# EAGLE design makey_makey (EAGLE 7.2.0)

## Sheet 1 of 2
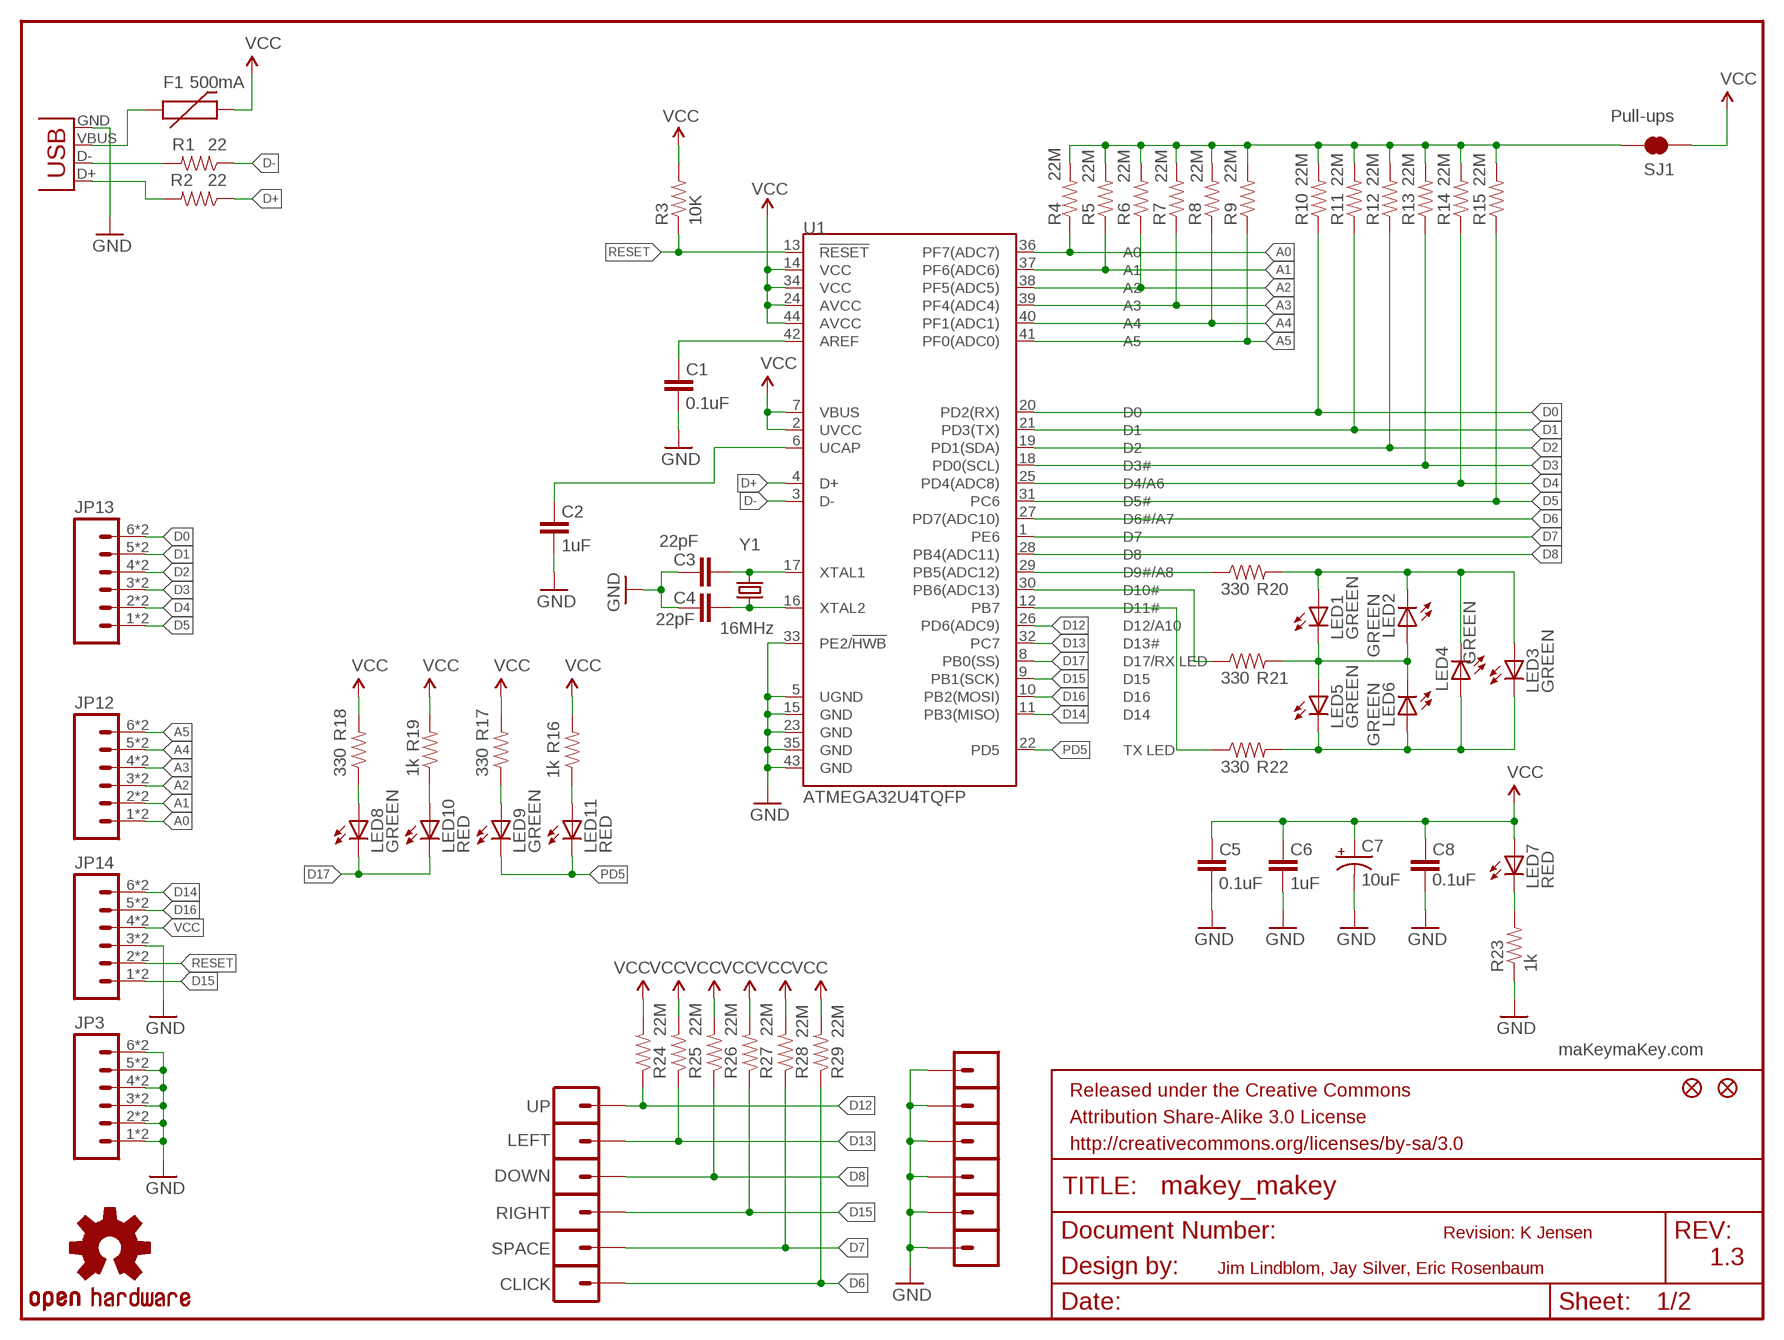
[diagram p0: schematic, sheet 1]

### Parts
C1  0.1uF  CAP0603-CAP  [0603-CAP]
C2  1uF  CAP0603-CAP  [0603-CAP]
C3  22pF  CAP0603-CAP  [0603-CAP]
C4  22pF  CAP0603-CAP  [0603-CAP]
C5  0.1uF  CAP0603-CAP  [0603-CAP]
C6  1uF  CAP0603-CAP  [0603-CAP]
C7  10uF  CAP_POL1206  [EIA3216]
C8  0.1uF  CAP0603-CAP  [0603-CAP]
CLICK  M01ALLIGATOR-3MM  [1X01_ALLIGATOR_3MM]
DOWN  M01ALLIGATOR-3MM  [1X01_ALLIGATOR_3MM]
F1  500mA  PTCSMD-W  [PTC-1206-WIDE]
JP1  FIDUCIALUFIDUCIAL  [MICRO-FIDUCIAL]
JP2  FIDUCIALUFIDUCIAL  [MICRO-FIDUCIAL]
JP3  M06SMD-STRAIGHT-COMBO  [1X06_SMD_STRAIGHT_COMBO]
JP5  M01ALLIGATOR-3MM  [1X01_ALLIGATOR_3MM]
JP6  M01ALLIGATOR-3MM  [1X01_ALLIGATOR_3MM]
JP7  M01ALLIGATOR-3MM  [1X01_ALLIGATOR_3MM]
JP8  M01ALLIGATOR-3MM  [1X01_ALLIGATOR_3MM]
JP10  M01ALLIGATOR-3MM  [1X01_ALLIGATOR_3MM]
JP11  M01ALLIGATOR-3MM  [1X01_ALLIGATOR_3MM]
JP12  M06SMD-STRAIGHT-COMBO  [1X06_SMD_STRAIGHT_COMBO]
JP13  M06SMD-STRAIGHT-COMBO  [1X06_SMD_STRAIGHT_COMBO]
JP14  M06SMD-STRAIGHT-COMBO  [1X06_SMD_STRAIGHT_COMBO]
LED1  GREEN  LED1206-BOTTOM  [LED-1206-BOTTOM]
LED2  GREEN  LED1206-BOTTOM  [LED-1206-BOTTOM]
LED3  GREEN  LED1206-BOTTOM  [LED-1206-BOTTOM]
LED4  GREEN  LED1206-BOTTOM  [LED-1206-BOTTOM]
LED5  GREEN  LED1206-BOTTOM  [LED-1206-BOTTOM]
LED6  GREEN  LED1206-BOTTOM  [LED-1206-BOTTOM]
LED7  RED  LED0603  [LED-0603]
LED8  GREEN  LED0603  [LED-0603]
LED9  GREEN  LED0603  [LED-0603]
LED10  RED  LED0603  [LED-0603]
LED11  RED  LED0603  [LED-0603]
LEFT  M01ALLIGATOR-3MM  [1X01_ALLIGATOR_3MM]
R1  22  RESISTOR0603-RES  [0603-RES]
R2  22  RESISTOR0603-RES  [0603-RES]
R3  10K  RESISTOR0603-RES  [0603-RES]
R4  22M  RESISTOR0603-RES  [0603-RES]
R5  22M  RESISTOR0603-RES  [0603-RES]
R6  22M  RESISTOR0603-RES  [0603-RES]
R7  22M  RESISTOR0603-RES  [0603-RES]
R8  22M  RESISTOR0603-RES  [0603-RES]
R9  22M  RESISTOR0603-RES  [0603-RES]
R10  22M  RESISTOR0603-RES  [0603-RES]
R11  22M  RESISTOR0603-RES  [0603-RES]
R12  22M  RESISTOR0603-RES  [0603-RES]
R13  22M  RESISTOR0603-RES  [0603-RES]
R14  22M  RESISTOR0603-RES  [0603-RES]
R15  22M  RESISTOR0603-RES  [0603-RES]
R16  1k  RESISTOR0603-RES  [0603-RES]
R17  330  RESISTOR0603-RES  [0603-RES]
R18  330  RESISTOR0603-RES  [0603-RES]
R19  1k  RESISTOR0603-RES  [0603-RES]
R20  330  RESISTOR0603-RES  [0603-RES]
R21  330  RESISTOR0603-RES  [0603-RES]
R22  330  RESISTOR0603-RES  [0603-RES]
R23  1k  RESISTOR0603-RES  [0603-RES]
R24  22M  RESISTOR0603-RES  [0603-RES]
R25  22M  RESISTOR0603-RES  [0603-RES]
R26  22M  RESISTOR0603-RES  [0603-RES]
R27  22M  RESISTOR0603-RES  [0603-RES]
R28  22M  RESISTOR0603-RES  [0603-RES]
R29  22M  RESISTOR0603-RES  [0603-RES]
RIGHT  M01ALLIGATOR-3MM  [1X01_ALLIGATOR_3MM]
SJ1  Pull-ups  SOLDERJUMPER-OLDTRACE  [SJ_2S-TRACE]
SPACE  M01ALLIGATOR-3MM  [1X01_ALLIGATOR_3MM]
U1  ATMEGA32U4TQFP  [TQFP44]
U$1  OSHW-LOGOM  [OSHW-LOGO-M]
UP  M01ALLIGATOR-3MM  [1X01_ALLIGATOR_3MM]
X1  USBSMD  [USB-MINIB]
Y1  16MHz  CRYSTAL5X3  [CRYSTAL-SMD-5X3]

### Nets
A0: JP12.1 JP12.1-2 R4.1 U1.36(PF7(ADC7))
A1: JP12.2 JP12.2-2 R5.1 U1.37(PF6(ADC6))
A2: JP12.3 JP12.3-2 R6.1 U1.38(PF5(ADC5))
A3: JP12.4 JP12.4-2 R7.1 U1.39(PF4(ADC4))
A4: JP12.5 JP12.5-2 R8.1 U1.40(PF1(ADC1))
A5: JP12.6 JP12.6-2 R9.1 U1.41(PF0(ADC0))
AREF: C1.2 U1.42(AREF)
D0: JP13.6 JP13.6-2 R10.1 U1.20(PD2(RX))
D1: JP13.5 JP13.5-2 R11.1 U1.21(PD3(TX))
D2: JP13.4 JP13.4-2 R12.1 U1.19(PD1(SDA))
D3: JP13.3 JP13.3-2 R13.1 U1.18(PD0(SCL))
D4: JP13.2 JP13.2-2 R14.1 U1.25(PD4(ADC8))
D5: JP13.1 JP13.1-2 R15.1 U1.31(PC6)
D6: CLICK.1@0 CLICK.1@2 R29.1 U1.27(PD7(ADC10))
D7: R28.1 SPACE.1@0 SPACE.1@2 U1.1(PE6)
D8: DOWN.1@0 DOWN.1@2 R26.1 U1.28(PB4(ADC11))
D9: R20.1 U1.29(PB5(ADC12))
D10: R21.1 U1.30(PB6(ADC13))
D11: R22.1 U1.12(PB7)
D12: R24.1 U1.26(PD6(ADC9)) UP.1@0 UP.1@2
D13: LEFT.1@0 LEFT.1@2 R25.1 U1.32(PC7)
D14: JP14.6 JP14.6-2 U1.11(PB3(MISO))
D15: JP14.1 JP14.1-2 R27.1 RIGHT.1@0 RIGHT.1@2 U1.9(PB1(SCK))
D16: JP14.5 JP14.5-2 U1.10(PB2(MOSI))
D17: LED8.C LED10.C U1.8(PB0(SS))
D+: R2.1 U1.4(D+)
D-: R1.1 U1.3(D-)
GND [vcc]: C1.1 C2.1 C3.2 C4.2 C5.1 C6.1 C7.C(-) C8.1 JP3.1 JP3.1-2 JP3.2 JP3.2-2 JP3.3 JP3.3-2 JP3.4 JP3.4-2 JP3.5 JP3.5-2 JP3.6 JP3.6-2 JP5.1@0 JP5.1@2 JP6.1@0 JP6.1@2 JP7.1@0 JP7.1@2 JP8.1@0 JP8.1@2 JP10.1@0 JP10.1@2 JP11.1@0 JP11.1@2 JP14.3 JP14.3-2 R23.1 U1.5(UGND) U1.15(GND) U1.23(GND) U1.33(PE2/!HWB) U1.35(GND) U1.43(GND) X1.GND
N$1: C4.1 U1.16(XTAL2) Y1.1
N$2: C3.1 U1.17(XTAL1) Y1.3
N$3: LED8.A R18.1
N$4: C2.2 U1.6(UCAP)
N$5: F1.1 X1.VBUS
N$6: R1.2 X1.D-
N$7: LED7.C R23.2
N$8: R2.2 X1.D+
N$9: LED11.A R16.1
N$10: LED10.A R19.1
N$11: LED9.A R17.1
N$24: LED1.C LED2.A LED5.A LED6.C R21.2
N$25: LED1.A LED2.C LED3.A LED4.C R20.2
N$26: LED3.C LED4.A LED5.C LED6.A R22.2
PD5: LED9.C LED11.C U1.22(PD5)
PULL-UP: R4.2 R5.2 R6.2 R7.2 R8.2 R9.2 R10.2 R11.2 R12.2 R13.2 R14.2 R15.2 SJ1.2
RESET: JP14.2 JP14.2-2 R3.1 U1.13(!RESET)
VCC: C5.2 C6.2 C7.A(+) C8.2 F1.2 JP14.4 JP14.4-2 LED7.A R3.2 R16.2 R17.2 R18.2 R19.2 R24.2 R25.2 R26.2 R27.2 R28.2 R29.2 SJ1.1 U1.2(UVCC) U1.7(VBUS) U1.14(VCC) U1.24(AVCC) U1.34(VCC) U1.44(AVCC)

### Notes on the sheet
- maKeymaKey.com
- Revision: K Jensen
- 1.3
- Jim Lindblom, Jay Silver, Eric Rosenbaum

## Sheet 2 of 2
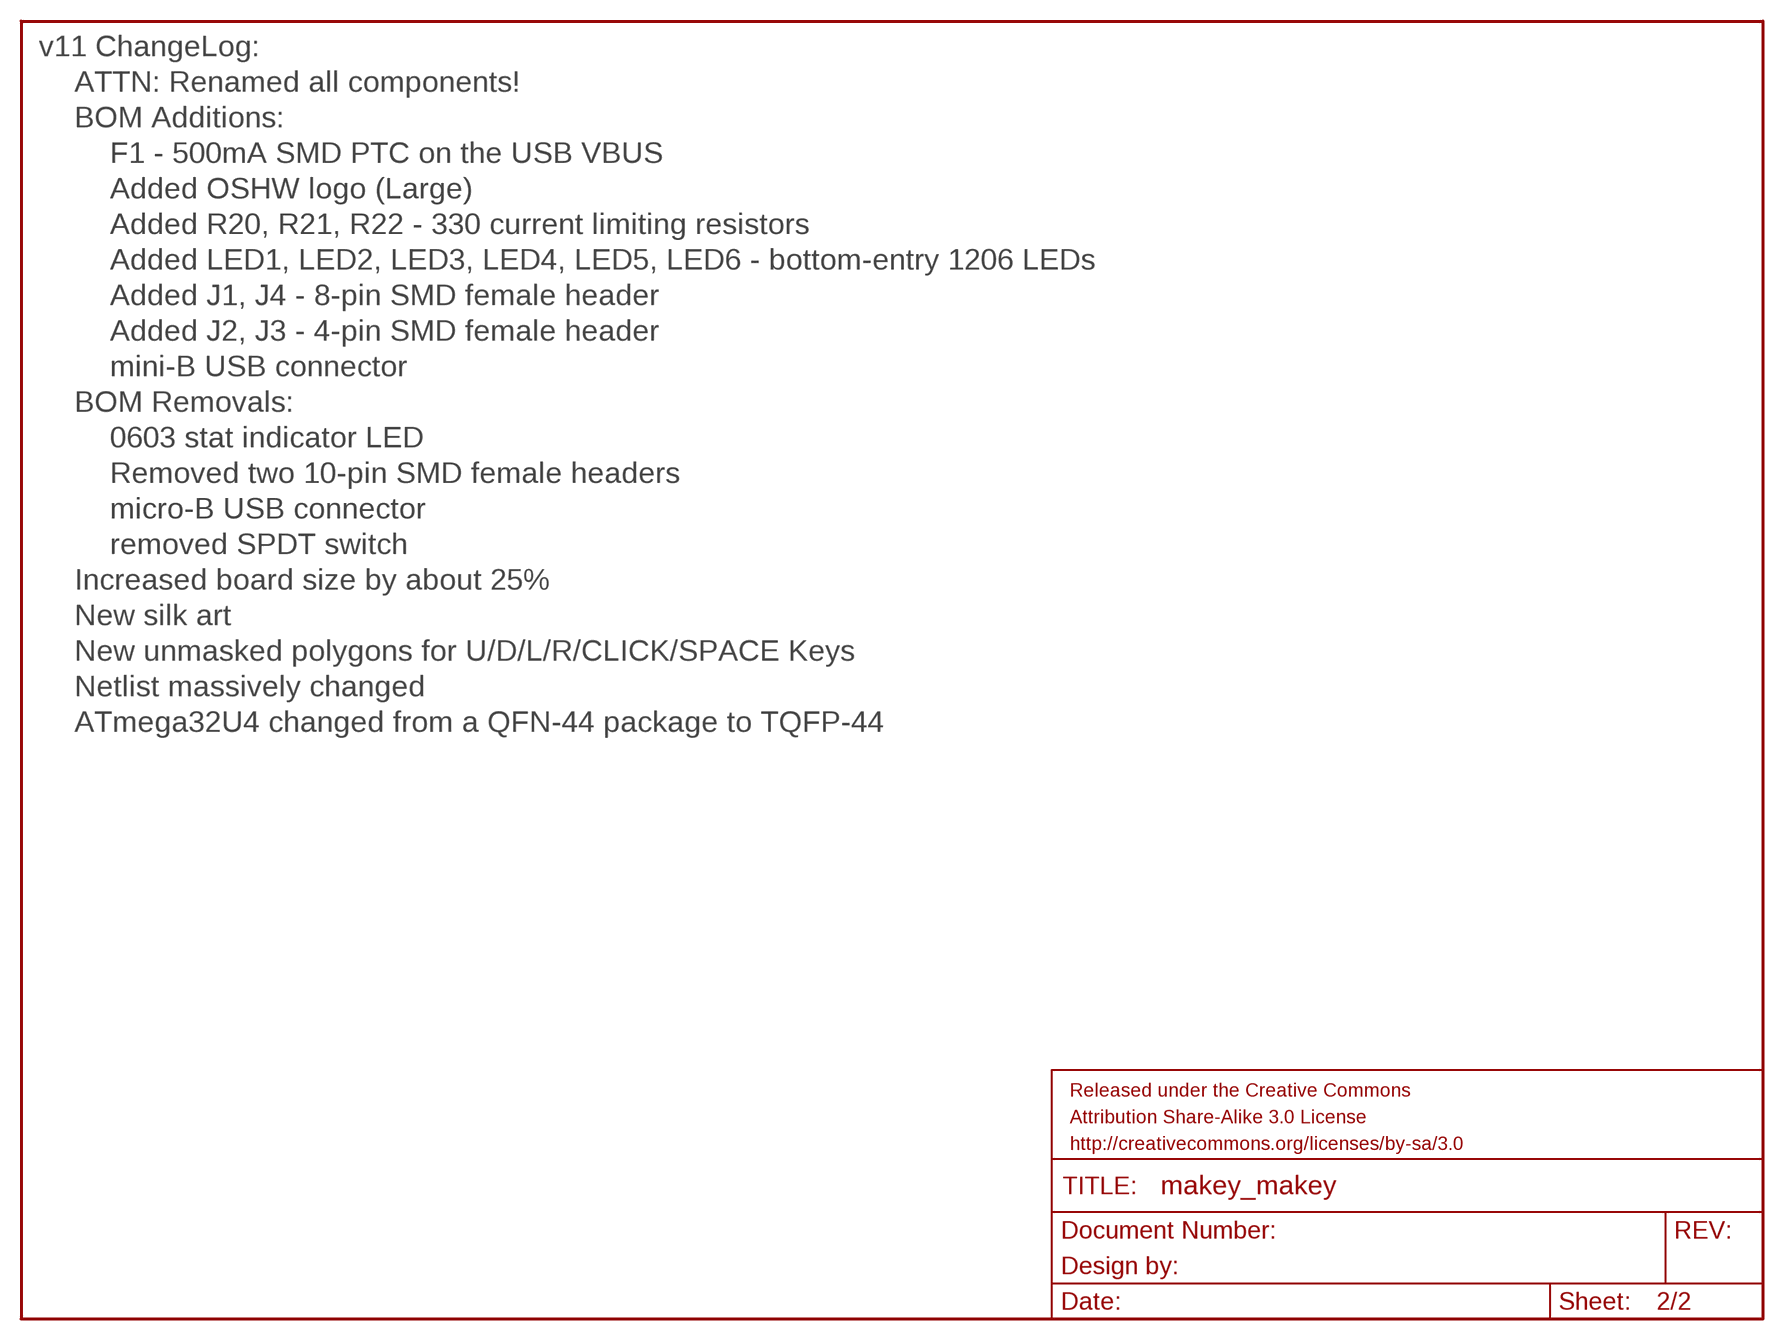
[diagram p1: schematic, sheet 2]

### Notes on the sheet
- v11 ChangeLog:
- ATTN: Renamed all components!
- BOM Additions:
- F1 - 500mA SMD PTC on the USB VBUS
- Added OSHW logo (Large)
- Added R20, R21, R22 - 330 current limiting resistors
- Added LED1, LED2, LED3, LED4, LED5, LED6 - bottom-entry 1206 LEDs
- Added J1, J4 - 8-pin SMD female header
- Added J2, J3 - 4-pin SMD female header
- mini-B USB connector
- BOM Removals:
- 0603 stat indicator LED
- Removed two 10-pin SMD female headers
- micro-B USB connector
- removed SPDT switch
- Increased board size by about 25%
- New silk art
- New unmasked polygons for U/D/L/R/CLICK/SPACE Keys
- Netlist massively changed
- ATmega32U4 changed from a QFN-44 package to TQFP-44

## Library data of the parts
C1-C6 C8 = SparkFun:CAP: Capacitor Standard 0603 ceramic capacitor, and 0.1" leaded capacitor.
C7 = SparkFun:CAP_POL: Capacitor Polarized These are standard SMD and PTH capacitors. Normally 10uF, 47uF, and 100uF in electrolytic and tantalum varieties. Always verify the external diameter of the through hole cap, it varies with capacity, voltage, and manufacturer. The EIA devices should be standard.
CLICK DOWN JP5-JP8 JP10 JP11 LEFT RIGHT SPACE UP = SparkFun-Connectors:M01: Header 1 Standard 1-pin 0.1" header. Use with straight break away headers (SKU : PRT-00116), right angle break away headers (PRT-00553), swiss pins (PRT-00743), machine pins (PRT-00117), and female headers (PRT-00115).
F1 = SparkFun-PowerIC:PTC: Resettable Fuse PTC Resettable Fuse. Spark Fun Electronics SKU : COM-08357
JP1 JP2 = SparkFun:FIDUCIAL: Fiducial Alignment Points Various fiducial points for machine vision alignment.
JP3 JP12-JP14 = SparkFun-Connectors:M06: Header 6 Standard 6-pin 0.1" header. Use with straight break away headers (SKU : PRT-00116), right angle break away headers (PRT-00553), swiss pins (PRT-00743), machine pins (PRT-00117), and female headers (PRT-00115). Molex polarized connector foot print use with SKU : PRT-08094 with associated crimp pins and housings. NOTES ON THE VARIANTS LOCK and LOCK_LONGPADS... This footprint was designed to help hold the alignment of a through-hole component (i.e. 6-pin header) while soldering it into place. You may notice that each hole has been shifted either up or down by 0.005 of an inch from it's more standard position (which is a perfectly straight line). This slight alteration caused the pins (the squares in the middle) to touch the edges of the holes. Because they are alternating, it causes a "brace" to hold the component in place. 0.005 has proven to be the perfect amount of "off-center" position when using our standard breakaway headers. Although looks a little odd when you look at the bare footprint, once you have a header in there, the alteration is very hard to notice. Also, if you push a header all the way into place, it is covered up entirely on the bottom side. This idea of altering the position of holes to aid alignment will be further integrated into the Sparkfun Library for other footprints. It can help hold any component with 3 or more connection pins.
LED1-LED6 LED8-LED11 = SparkFun-LED:LED: LEDs Standard schematic elements and footprints for 5mm, 3mm, 1206, and 0603 sized LEDs. 5mm - Spark Fun Electronics SKU : COM-00529 (and others)
LED7 = SparkFun:LED: LEDs Standard schematic elements and footprints for 5mm, 3mm, 1206, and 0603 sized LEDs. 5mm - Spark Fun Electronics SKU : COM-00529 (and others)
R1-R15 R23-R29 = SparkFun:RESISTOR: Resistor Basic schematic elements and footprints for 0603, 1206, and PTH resistors.
R16-R22 = SparkFun-Passives:RESISTOR: Resistor Basic schematic elements and footprints for 0603, 1206, and PTH resistors.
SJ1 = SparkFun:SOLDERJUMPER-OLD: Solder Jumper Standard SMD solder jumper. Used to automate production. Two varients : Normally Open and Normally Closed are the same, but have different paste layers. NC will have a large amount of paste and should jumper during reflow.
U1 = SparkFun-DigitalIC:ATMEGA32U4: Atmel 44-pin 8-bit Microcontroller with 32KBytes of ISP Flash and USB Controller
U$1 = SparkFun-Aesthetics:OSHW-LOGO: Open Source Hardware Logo This logo indicates the piece of hardware it is found on incorporates a OSHW license and/or adheres to the definition of open source hardware found here: http://freedomdefined.org/OSHW
X1 = SparkFun:USB: USB Connectors USB-B-PTH is fully proven SKU : PRT-00139 USB-miniB is fully proven SKU : PRT-00587 USB-A-PCB is untested. USB-A-H is throughly reviewed, but untested. Spark Fun Electronics SKU : PRT-00437 USB-B-SMT is throughly reviewed, but untested. Needs silkscreen touching up. USB-A-S has not been used/tested USB-MB-H has not been used/tested
Y1 = SparkFun:CRYSTAL: Crystals Various standard crystals. Proven footprints. Spark Fun Electronics SKU : COM-00534

## Net classes
0 default: width 0.203 mm

## Board
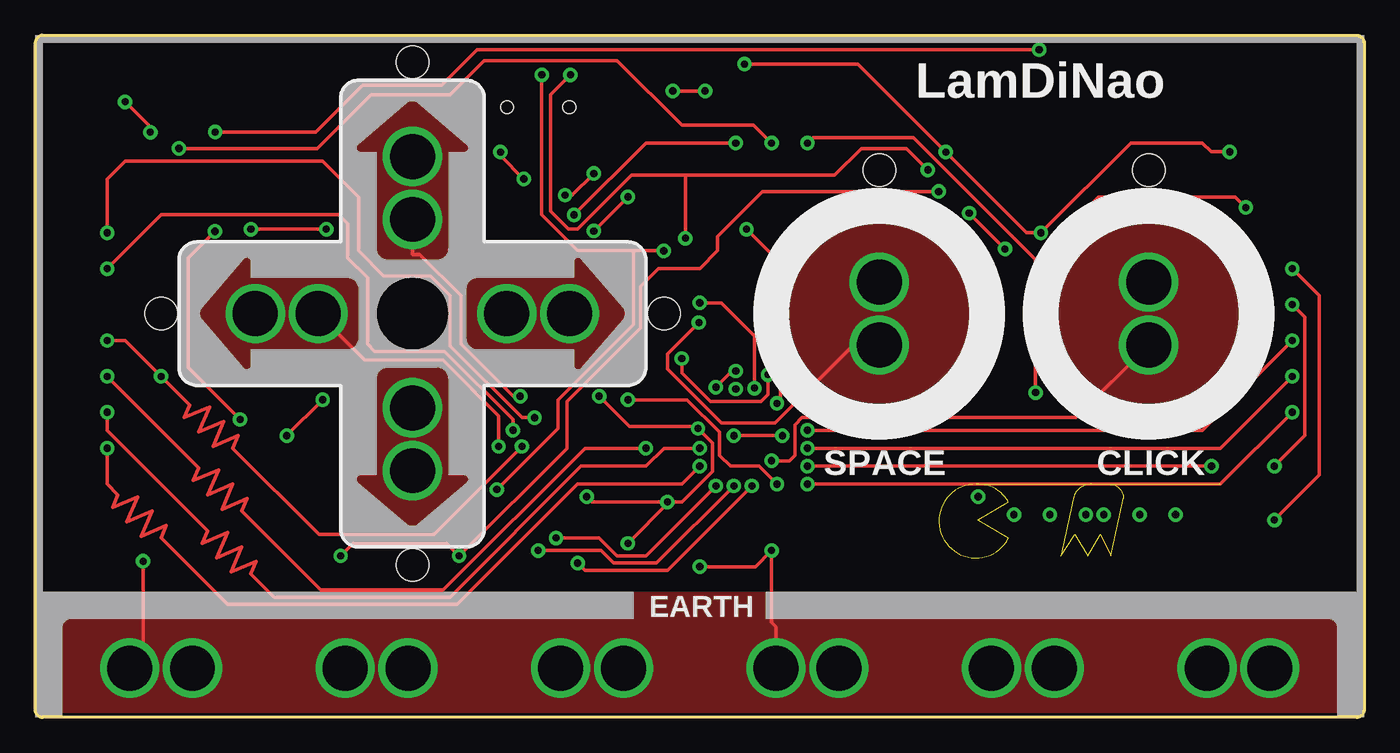
[diagram p2: board, top side]
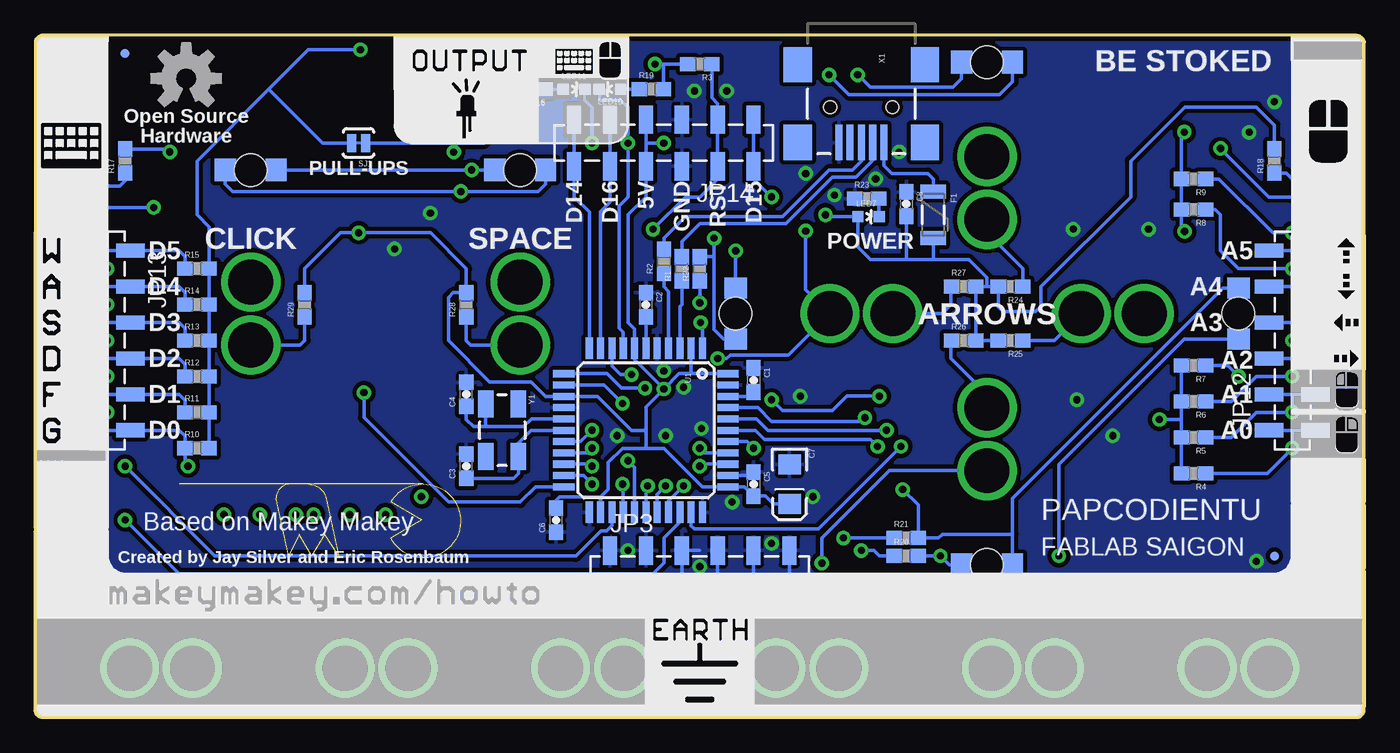
[diagram p3: board, bottom side, seen from below]

Size 93.98 x 48.26 mm. Coordinates in mm from the lower left corner, seen from the top.
Outline: 0,0.54 0,47.72 arc-90 0.54,48.26 93.44,48.26 arc-90 93.98,47.72 93.98,0.54 arc-90 93.44,0 0.54,0 arc-90 0,0.54
Copper layers (1*16): Top 0.035mm / dielectric 1.5mm / Bottom 0.035mm
Design rules "default": minimum track width 8mil, minimum drill 20mil, track to track 8mil, track to pad 8mil, pad to pad 8mil, via to via 8mil, smd to smd 8mil, copper to edge 8mil, drill to drill 8mil, minimum pad ring 12mil, minimum via ring 10mil, stop-mask expansion 4mil, vias tented up to drill 20mil, thermal gap 10mil
bRestrict: area 52.3,45.3 to 57.1,47.6

### Footprints (pad centres in the part's own frame; a part is rotated, then mirrored left to right if it is on the bottom)
0603-CAP = smd 1.1 x 1: 1 -0.85,0; 2 0.85,0
EIA3216 = smd 1.4 x 1.6: A 1.4,0; C -1.4,0
1X01_ALLIGATOR_3MM = drill 3.175: 1@0 0,2.223; 1@2 0,-2.223
PTC-1206-WIDE = smd 1 x 1.8: 1 -1.654,0; 2 1.654,0
MICRO-FIDUCIAL = smd 0.635 x 0.635: 1 0,0
1X06_SMD_STRAIGHT_COMBO = smd 1 x 2: 1 0,-1.65; 1-2 0,1.65; 2 2.54,1.65; 2-2 2.54,-1.65; 3 5.08,-1.65; 3-2 5.08,1.65; 4 7.62,1.65; 4-2 7.62,-1.65; 5 10.16,-1.65; 5-2 10.16,1.65; 6 12.7,1.65; 6-2 12.7,-1.65
LED-1206-BOTTOM = smd 1.5 x 1.6: A -1.8,0; C 1.8,0 | hole 2.3: 0,0
LED-0603 = smd 0.8 x 0.8: A 0,-0.75; C 0,0.75
0603-RES = smd 1.1 x 1: 1 -0.85,0; 2 0.85,0
SJ_2S-TRACE = smd 0.635 x 1.27: 1 -0.508,0; 2 0.508,0
TQFP44 = smd 1.5 x 0.5: 1 -5.8,4; 2 -5.8,3.2; 3 -5.8,2.4; 4 -5.8,1.6; 5 -5.8,0.8; 6 -5.8,0; 7 -5.8,-0.8; 8 -5.8,-1.6; 9 -5.8,-2.4; 10 -5.8,-3.2; 11 -5.8,-4; 23 5.8,-4; 24 5.8,-3.2; 25 5.8,-2.4; 26 5.8,-1.6; 27 5.8,-0.8; 28 5.8,0; 29 5.8,0.8; 30 5.8,1.6; 31 5.8,2.4; 32 5.8,3.2; 33 5.8,4 | smd 0.5 x 1.5: 12 -4,-5.8; 13 -3.2,-5.8; 14 -2.4,-5.8; 15 -1.6,-5.8; 16 -0.8,-5.8; 17 0,-5.8; 18 0.8,-5.8; 19 1.6,-5.8; 20 2.4,-5.8; 21 3.2,-5.8; 22 4,-5.8; 34 4,5.8; 35 3.2,5.8; 36 2.4,5.8; 37 1.6,5.8; 38 0.8,5.8; 39 0,5.8; 40 -0.8,5.8; 41 -1.6,5.8; 42 -2.4,5.8; 43 -3.2,5.8; 44 -4,5.8
USB-MINIB = smd 2.5 x 0.5: D+ 2.5,0; D- 2.5,0.8; GND 2.5,-1.6; ID 2.5,-0.8; VBUS 2.5,1.6 | smd 2.5 x 2: MTN1 -3,4.5; MTN2 2.5,4.5; MTN3 -3,-4.5; MTN4 2.5,-4.5 | hole 0.9: 0,2.2; 0,-2.2
CRYSTAL-SMD-5X3 = smd 1.9 x 1.1: 1 -1.85,-1.15; 2 1.85,-1.15; 3 1.85,1.15; 4 -1.85,1.15

### Placement (x,y rotation side)
C1  43.18,23.88 270 bottom
C2  50.8,29.21 270 bottom
C3  63.5,17.78 90 bottom
C4  63.5,22.86 90 bottom
C5  43.18,16.51 270 bottom
C6  57.15,13.97 90 bottom
C7  40.64,16.51 270 bottom
C8  32.38,36.32 270 bottom
CLICK  78.74,28.57 180 bottom
DOWN  26.67,19.68 0 top
F1  30.48,35.56 270 bottom
JP1  87.63,46.99 0 bottom
JP2  6.35,11.43 0 bottom
JP3  53.34,10.16 0 bottom
JP5  85.09,3.49 90 top
JP6  69.85,3.49 90 top
JP7  54.61,3.49 90 top
JP8  39.37,3.49 90 top
JP10  24.13,3.49 90 top
JP11  8.89,3.49 90 top
JP12  5.08,20.32 90 bottom
JP13  88.9,33.02 270 bottom
JP14  43.18,40.64 180 bottom
LED1  26.67,10.79 0 bottom
LED2  8.89,28.57 270 bottom
LED3  78.74,38.73 0 bottom
LED4  59.69,38.73 0 bottom
LED5  26.67,46.35 0 bottom
LED6  44.45,28.57 90 bottom
LED7  35.05,35.43 270 bottom
LED8  2.54,36.83 180 bottom
LED9  91.44,36.83 180 bottom
LED10  53.34,44.45 90 bottom
LED11  55.88,44.45 270 bottom
LEFT  17.78,28.57 270 top
R1  48.26,31.75 90 bottom
R2  49.53,32.26 90 bottom
R3  46.99,46.23 180 bottom
R4  12.06,17.27 180 bottom
R5  12.06,19.81 180 bottom
R6  12.06,22.35 180 bottom
R7  12.06,24.89 180 bottom
R8  12.06,35.94 180 bottom
R9  12.06,38.1 180 bottom
R10  82.55,19.05 0 bottom
R11  82.55,21.59 0 bottom
R12  82.55,24.13 0 bottom
R13  82.55,26.67 0 bottom
R14  82.55,29.21 0 bottom
R15  82.55,31.75 0 bottom
R16  58.8,44.45 180 bottom
R17  87.63,39.37 90 bottom
R18  6.35,39.37 90 bottom
R19  50.42,44.45 0 bottom
R20  32.38,11.43 0 bottom
R21  32.38,12.7 0 bottom
R22  46.99,31.75 90 bottom
R23  35.18,36.7 0 bottom
R24  25.02,30.48 180 bottom
R25  25.02,26.67 180 bottom
R26  28.32,26.67 0 bottom
R27  28.32,30.48 0 bottom
R28  63.5,29.21 90 bottom
R29  74.93,29.21 90 bottom
RIGHT  35.56,28.57 270 top
SJ1  71.12,40.64 180 bottom
SPACE  59.69,28.57 180 bottom
U1  50.8,20.32 270 bottom
U$1  83.31,45.21 0 bottom
UP  26.67,37.47 0 top
X1  35.56,43.18 270 bottom
Y1  60.96,20.32 270 bottom

### Tracks (layer width: path | path; a pad name or v marks a point on that pad's centre or on a via)
A0  (via drill 0.51)
  Top 0.254: v46.99,17.78 45.72,16.51 38.35,16.51 29.84,8 13.59,8 8.89,12.7 9.27,13.59 7.49,12.83 8.26,14.61 6.48,13.84 7.24,15.62 5.46,14.86 5.84,15.75 5.08,16.51 v5.08,19.05
  Bottom 0.254: JP12.1-2 5.08,20.32 | 5.08,20.32 JP12.1 | U1.36 46.85,17.92 v46.99,17.78 | 5.08,20.32 v5.08,19.05 6.86,17.27 R4.1
A1  (via drill 0.51)
  Top 0.254: v46.99,19.05 44.45,19.05 43.18,17.78 38.61,17.78 29.34,8.51 16.89,8.51 15.24,10.16 15.62,11.05 13.84,10.29 14.61,12.06 12.83,11.3 13.59,13.08 11.81,12.32 12.19,13.21 5.08,20.32 v5.08,21.59
  Bottom 0.254: JP12.2-2 5.08,22.86 | 5.08,22.86 JP12.2 | U1.37 46.66,18.72 v46.99,19.05 | 5.08,22.86 v5.08,21.59 7.62,21.59 9.4,19.81 R5.1
A2  (via drill 0.51)
  Top 0.254: v43.18,19.05 38.86,19.05 28.83,9.02 20.19,9.02 14.61,14.61 14.99,15.49 13.21,14.73 13.97,16.51 12.19,15.75 12.95,17.53 11.18,16.76 11.56,17.65 v5.08,24.13
  Bottom 0.254: JP12.3-2 5.08,25.4 | 5.08,25.4 JP12.3 | U1.38 43.65,19.52 v43.18,19.05 | 5.08,25.4 v5.08,24.13 7.62,24.13 9.4,22.35 R6.1
A3  (via drill 0.51)
  Top 0.254: v34.42,19.18 28.19,12.95 20.07,12.95 13.97,19.05 14.35,19.94 12.57,19.18 13.34,20.95 11.56,20.19 12.32,21.97 10.54,21.21 10.92,22.1 v8.89,24.13 6.35,26.67 v5.08,26.67
  Bottom 0.254: JP12.4 5.08,27.94 | 5.08,27.94 JP12.4-2 | U1.39 43.05,20.32 42.42,19.68 34.92,19.68 v34.42,19.18 | v5.08,26.67 5.08,27.94 | R7.1 9.65,24.89 v8.89,24.13
A4  (via drill 0.51)
  Top 0.254: v5.08,31.75 8.89,35.56 21.46,35.56 22.1,34.92 22.1,32.51 23.5,31.11 23.5,26.42 24,25.91 28.96,25.91 33.78,21.08 v33.78,20.32
  Bottom 0.254: JP12.5-2 5.08,30.48 | 5.08,30.48 JP12.5 | 5.08,30.48 v5.08,31.75 8.89,31.75 10.16,33.02 10.16,35.56 10.54,35.94 R8.1 | U1.40 42.96,21.12 42.16,20.32 v33.78,20.32
A5  (via drill 0.51)
  Top 0.254: v5.08,34.29 5.08,38.1 6.35,39.37 20.32,39.37 22.86,36.83 22.86,33.02 24.64,31.24 27.94,31.24 29.34,29.84 29.34,26.29 34.42,21.21 v35.31,21.21
  Bottom 0.254: JP12.6 5.08,33.02 | 5.08,33.02 JP12.6-2 | 5.08,33.02 v5.08,34.29 6.48,34.29 10.29,38.1 R9.1 | U1.41 42.88,21.92 41.91,20.95 35.56,20.95 v35.31,21.21
AREF
  Bottom 0.254: 43.18,22.86 C1.2 43.49,22.72 U1.42
D0  (via drill 0.51)
  Top 0.254: v54.61,17.78 v83.19,17.78
  Bottom 0.254: U1.20 54.75,17.92 v54.61,17.78 | JP13.6-2 JP13.6 83.82,20.32 83.4,19.9 R10.1 83.4,18 v83.19,17.78
D1  (via drill 0.51)  (15 unrouted)
  Top 0.254: v88.9,21.59 83.82,16.51 v54.61,16.51
  Bottom 0.254: U1.21 55.22,17.12 v54.61,16.51 | JP13.5 88.9,22.86 | 88.9,22.86 JP13.5-2 83.82,22.86 83.4,22.44 R11.1 | v88.9,21.59 88.9,22.86
D2  (via drill 0.51)
  Top 0.254: v54.61,19.05 83.82,19.05 v88.9,24.13
  Bottom 0.254: U1.19 54.94,18.72 v54.61,19.05 | v88.9,24.13 88.9,25.4 | 88.9,25.4 JP13.4-2 | 88.9,25.4 JP13.4 83.82,25.4 83.4,24.98 R12.1
D3  (via drill 0.51)
  Top 0.254: v88.9,26.67 82.55,20.32 v54.61,20.32
  Bottom 0.254: U1.18 55.41,19.52 v54.61,20.32 | 88.9,27.94 JP13.3-2 83.82,27.94 83.4,27.52 R13.1 | 88.9,27.94 JP13.3 | v88.9,26.67 88.9,27.94
D4  (via drill 0.51)
  Top 0.254: v87.63,17.78 89.79,19.94 89.79,28.32 v88.9,29.21
  Bottom 0.254: 88.9,30.48 JP13.2 83.82,30.48 83.4,30.06 R14.1 | 88.9,30.48 JP13.2-2 | v87.63,17.78 81.28,11.43 55.75,11.43 53.98,13.21 53.57,13.21 53.2,13.58 U1.25 | v88.9,29.21 88.9,30.48
D5  (via drill 0.51)
  Top 0.254: v87.63,13.97 90.81,17.14 90.81,29.84 v88.9,31.75
  Bottom 0.254: v87.63,13.97 83.82,10.16 50.29,10.16 49.53,10.92 49.53,12.7 48.4,13.83 U1.31 | 88.9,33.02 JP13.1-2 83.82,33.02 83.4,32.6 R15.1 | 88.9,33.02 JP13.1 | v88.9,31.75 88.9,33.02
D6  (via drill 0.51)
  Top 0.254: v52.07,18.16 53.34,18.16 53.72,18.54 53.72,20.7 54.23,21.21 73.6,21.21 CLICK.1@0
  Bottom 0.254: U1.27 51.6,17.69 v52.07,18.16 | CLICK.1@0 75.25,26.35 74.93,26.67 R29.1
  pour Top (no thermals): 72.39,28.57 arc-90 78.74,34.92 arc-90 85.09,28.57 arc-90 78.74,22.23 arc-90
D7  (via drill 0.51)
  Top 0.254: v46.93,27.94 44.7,25.72 44.7,24.64 48.51,20.83 52.32,20.83 57.85,26.35 SPACE.1@0
  Bottom 0.254: U1.1 46.8,27.81 v46.93,27.94 | SPACE.1@0 63.18,26.35 63.5,26.67 R28.1
  pour Top (no thermals): 53.34,28.57 arc-90 59.69,34.92 arc-90 66.04,28.57 arc-90 59.69,22.23 arc-90
D8  (via drill 0.51)
  Top 0.254: v50.67,16.38 44.7,10.41 38.86,10.41 v38.35,10.92
  Bottom 0.254: U1.28 50.8,16.26 v50.67,16.38 | v38.35,10.92 38.35,12.7 33.59,17.46 DOWN.1@2 | DOWN.1@0 26.67,22.86 29.21,25.4 29.21,26.63 R26.1
  pour Top (no thermals): 29.21,17.14 29.21,23.95 arc90 28.4,24.77 24.94,24.77 arc90 24.13,23.95 24.13,17.14 22.99,17.14 arc139 22.81,16.65 26.26,13.69 arc81 27.08,13.69 30.53,16.65 arc139 30.35,17.14
D9  (via drill 0.51)
  Top 0.254: v49.4,16.38 43.94,10.92 40.89,10.92 40.01,11.81 v35.56,11.81
  Bottom 0.254: U1.29 50,15.79 v49.4,16.38 | v35.56,11.81 34.67,11.81 34.29,11.43 R20.1
D10  (via drill 0.51)
  Top 0.254: v48.13,16.38 43.18,11.43 41.15,11.43 39.88,12.7 v36.83,12.7
  Bottom 0.254: U1.30 49.2,15.32 v48.13,16.38 | R21.1 v36.83,12.7
D11  (via drill 0.51)
  Top 0.254: v50.86,23.3 50.86,26.99 48.51,29.34 v46.99,29.34
  Bottom 0.254: U1.12 53.53,24.32 52.51,23.3 v50.86,23.3 | v46.99,29.34 R22.1
D12  (via drill 0.51)
  Top 0.254: v52.45,16.51 51.18,17.78 49.15,17.78 48.39,18.54 48.39,20.19 46.1,22.48 v41.91,22.48 | v34.29,22.73 33.78,22.73 30.1,26.42 30.1,29.84 27.18,32.77 26.67,32.77 UP.1@2
  Bottom 0.254: U1.26 52.4,16.46 v52.45,16.51 | v41.91,22.48 41.15,21.72 37.59,21.72 36.58,22.73 v34.29,22.73 | UP.1@2 26.67,34.29 24.13,31.75 24.13,30.52 R24.1
  pour Top (no thermals): 24.13,40.01 24.13,33.2 arc90 24.94,32.38 28.4,32.38 arc90 29.21,33.2 29.21,40.01 30.35,40.01 arc139 30.53,40.5 27.08,43.46 arc81 26.26,43.46 22.81,40.5 arc139 22.99,40.01
D13  (via drill 0.51)
  Top 0.254: v32.77,19.18 32.77,21.34 28.83,25.27 23.3,25.27 LEFT.1@0
  Bottom 0.254: U1.32 47.6,13.56 47.37,13.34 38.61,13.34 v32.77,19.18 | R25.1 21.91,26.67 LEFT.1@0
  pour Top (no thermals): 15.24,26.04 22.05,26.04 arc90 22.86,26.85 22.86,30.3 arc90 22.05,31.11 15.24,31.11 15.24,32.25 arc139 14.74,32.44 11.78,28.99 arc81 11.78,28.16 14.74,24.71 arc139 15.24,24.9
D14
  Bottom 0.254: JP14.6 JP14.6-2 | JP14.6 55.88,41.91 | U1.11 54.8,35.75 55.88,36.83 JP14.6
D15  (via drill 0.51)
  Top 0.254: v51.82,24.26 51.82,22.86 51.31,22.35 47.75,22.35 45.72,24.38 v45.72,25.4 | v41.91,36.83 v39.5,34.42
  Bottom 0.254: U1.9 53.2,24.88 52.58,24.26 v51.82,24.26 | v45.72,25.4 45.09,25.4 44.83,25.65 40.7,25.65 RIGHT.1@0 39.5,30.29 v39.5,34.42 | JP14.1 JP14.1-2 43.18,38.1 v41.91,36.83 | RIGHT.1@2 29.84,28.57 29.21,29.21 29.21,30.44 R27.1
  pour Top (no thermals): 38.1,31.11 31.29,31.11 arc90 30.48,30.3 30.48,26.85 arc90 31.29,26.04 38.1,26.04 38.1,24.9 arc139 38.6,24.71 41.56,28.16 arc81 41.56,28.99 38.6,32.44 arc139 38.1,32.25
D16
  Bottom 0.203: JP14.5 53.21,42.29
  Bottom 0.254: JP14.5 JP14.5-2 53.34,36.45 54,35.79 U1.10
D17  (via drill 0.51)
  Top 0.254: v10.16,40.26 19.94,40.26 23.75,44.07 29.34,44.07 31.75,46.48 41.15,46.48 45.72,41.91 50.8,41.91 v52.07,40.64
  Bottom 0.254: U1.8 52.4,27.25 52.7,27.56 52.7,36.2 52.07,36.83 v52.07,40.64 52.07,43.18 52.58,43.69 53.98,43.69 54.09,43.8 LED10.C | LED8.C 4.33,36.08 5.08,36.83 6.73,36.83 v10.16,40.26
D+
  Bottom 0.254: U1.4 49.2,30.15 49.53,30.48 R2.1
D-
  Bottom 0.254: U1.3 48.4,29.07 48.26,29.21 R1.1
GND  (via drill 0.51)
  Top 0.254: v44.7,15.24 45.72,15.24 47.88,17.4 47.88,19.43 v46.86,20.45 46.74,20.57 42.04,20.57 v39.88,22.73 | v49.53,24.51 49.28,24.51 v48.13,23.37 | v37.47,36.96 37.97,36.96 v39.5,38.48 | v41.91,12.32 44.83,15.24 v44.7,15.24 | JP7.1@0 52.39,6.41 52.07,6.73 v52.07,11.81 50.93,10.67 v46.99,10.67 | v44.7,15.24 39.37,15.24 v38.99,15.62 | v52.83,19.94 v49.4,19.94 | v45.09,44.32 v47.37,44.32 | v66.04,35.69 v68.58,33.15 | v20.32,22.48 v17.78,19.94 | v20.57,34.54 v15.24,34.54 | JP11.1@0 7.62,3.49 v7.62,11.05 | v32.89,40.01 32.89,39.75 v34.54,38.1 | v6.35,43.56 8.13,41.78 v8.13,41.4
  Bottom 0.254: JP3.3-2 46.99,11.81 | JP3.2-2 52.96,8.51 53.34,8.89 | JP3.1 JP3.2-2 | 41.02,8.51 40.64,8.89 | 40.64,8.89 40.64,11.43 | JP3.5 43.18,11.43 | JP3.4-2 45.72,11.43 | JP3.3 48.26,11.43 | JP3.2-2 JP3.6-2 40.64,8.89 | U1.35 43.42,17.12 C5.1
  pour Top (no thermals): 1.91,0 1.91,6.35 arc-90 2.54,6.99 42.29,6.99 42.29,8.89 51.69,8.89 51.69,6.99 91.44,6.99 arc-90 92.08,6.35 92.08,0
  pour Bottom (isolate 0.305): 5.08,48.26 5.08,10.16 88.9,10.16 88.9,48.26
N$1
  Bottom 0.254: U1.16 58.89,21.12 59.44,20.57 62.1,20.57 | 62.1,20.57 62.99,20.57 63.5,21.08 C4.1 | Y1.1 62.15,22.21 62.15,20.62 62.1,20.57
N$2
  Bottom 0.254: U1.17 58.93,20.32 59.81,19.44 Y1.3 59.81,17.28 60.16,16.93 C3.1
N$3
  Bottom 0.254: R18.1 5.5,38.52 4.56,37.58 LED8.A
N$4
  Bottom 0.254: U1.6 C2.2
N$5
  Bottom 0.254: X1.VBUS 33.96,39.04 33.4,38.48 30.86,38.48 30.48,38.1 F1.1
N$6
  Bottom 0.254: X1.D- 34.76,39.41 35.94,38.23 37.59,38.23 40.89,34.92 46.99,34.92 48.26,33.66 R1.2
N$7
  Bottom 0.254: LED7.C 34.3,36.68 R23.2
N$8
  Bottom 0.254: X1.D+ 35.56,39.37 36.2,38.73 37.85,38.73 41.15,35.43 48.01,35.43 49.53,33.91 R2.2
N$9
  Bottom 0.254: LED11.A R16.1
  pour Top: 45.24,7.99 45.24,8.05 45.55,8.37 45.87,8.05 45.87,7.99
N$10
  Bottom 0.254: R19.1 LED10.A
  pour Top: 46.64,7.91 46.64,8.41 47.13,8.41 47.28,8.26 47.28,7.92 47.13,7.77 46.64,7.77 46.64,7.91 46.64,7.91
N$11
  Bottom 0.254: LED9.A 88.02,37.58 87.63,37.97 R17.1
N$12  (via drill 0.51)
  other vias: 66.67,15.62
N$13  (via drill 0.51)
  other vias: 69.22,14.35
N$14  (via drill 0.51)
  other vias: 74.3,14.35
N$15  (via drill 0.51)
  other vias: 71.75,14.35
N$16  (via drill 0.51)
  other vias: 75.56,14.35
N$17  (via drill 0.51)
  other vias: 78.11,14.35
N$18  (via drill 0.51)
  other vias: 80.64,14.35
N$24  (via drill 0.51)
  Top 0.254: v32.64,16.13 36.96,20.45 36.96,22.48 42.29,27.81 42.29,33.02 | v44.45,33.02 42.29,33.02 | v35.81,45.47 35.81,35.56 38.35,33.02 42.29,33.02
  Bottom 0.254: 24.87,12.95 29.84,12.95 30.1,12.7 R21.2 31.54,15.03 v32.64,16.13 | LED2.A 10.01,30.38 24.87,15.52 24.87,12.95 | v44.45,33.02 LED6.C | v35.81,45.47 34.92,44.58 29.08,44.58 28.47,45.19 LED5.A | LED1.C 24.87,12.95
N$25  (via drill 0.51)
  Top 0.254: v21.59,11.43 22.48,12.32 29.08,12.32 v29.97,11.43 37.59,19.05 37.59,22.35 42.8,27.56 42.8,30.48 44.07,31.75 46.99,31.75 48.26,33.02 48.26,34.04 51.44,37.21 v63.88,37.21
  Bottom 0.254: LED2.C 12.72,26.77 21.59,17.91 v21.59,11.43 | LED1.A 29.34,10.79 v29.97,11.43 R20.2 | LED3.A 80.54,37.74 80.01,37.21 v63.88,37.21 58.42,37.21 57.89,37.74 LED4.C
N$26  (via drill 0.51)
  Top 0.254: 45.97,38.35 42.16,38.35 38.35,34.54 37.72,34.54 36.45,35.81 36.45,44.07 v37.85,45.47 | 45.97,38.35 56.52,38.35 58.42,40.26 61.59,40.26 v63.12,38.73 | v45.97,33.91 45.97,38.35
  Bottom 0.254: v45.97,33.91 45.97,32.64 | 45.97,32.64 45.97,27.43 45.32,26.77 LED6.A | v37.85,45.47 36.45,44.07 25.78,44.07 24.87,44.98 LED5.C | LED4.A v63.12,38.73 LED3.C | R22.2 46.01,32.6 45.97,32.64
N$29
  pour Top: 45.24,7.99 45.24,8.05 45.55,8.37 45.87,8.05 45.87,7.99
N$30
  pour Top: 46.64,7.91 46.64,8.41 47.13,8.41 47.28,8.26 47.28,7.92 47.13,7.77 46.64,7.77 46.64,7.91 46.64,7.91
PD5  (via drill 0.51)
  Top 0.254: 70.74,32.38 62.1,41.02 54.99,41.02 v54.61,40.64 | v85.61,36.08 84.86,36.83 75.18,36.83 70.74,32.38 | 70.74,32.38 v70.74,22.99
  Bottom 0.254: LED9.C v85.61,36.08 | LED11.C 55.13,43.7 54.61,43.18 v54.61,40.64 | U1.22 58.61,16.32 59.69,15.24 64.77,15.24 70.74,21.21 v70.74,22.99
PULL-UP  (via drill 0.51)
  Top 0.254: v70.99,47.24 31.24,47.24 28.72,44.72 23.13,44.72 19.83,41.42 v12.71,41.42 | v12.7,34.39 10.79,32.49 10.79,24.77 v14.48,21.08
  Bottom 0.254: R10.2 R11.2 R12.2 R13.2 R14.2 R15.2 81.7,34.71 82.55,35.56 82.55,39.37 77.47,44.45 | 77.47,44.45 74.68,47.24 v70.99,47.24 | SJ1.2 73.66,40.64 77.47,44.45 | R7.2 R6.2 12.91,20.95 | 12.91,20.95 R5.2 R4.2 | v14.48,21.08 13.04,21.08 12.91,20.95 | v12.71,41.42 12.91,41.22 R9.2 R8.2 12.91,34.61 v12.7,34.39
RESET  (via drill 0.51)
  Top 0.254: v50.29,34.54 52.7,32.13 52.7,22.48 v52.45,22.23
  Bottom 0.254: U1.13 53.75,23.52 v52.45,22.23 | v50.29,34.54 48.01,36.83 46.99,36.83 45.72,38.1 JP14.2 JP14.2-2 45.72,43.43 46.14,43.85 R3.1
VCC  (via drill 0.51)
  Top 0.254: v38.1,35.56 43.18,40.64 v49.53,40.64 | v84.47,40.02 83.17,40.02 82.55,40.64 77.47,40.64 v71.12,34.29 70.1,34.29 v64.39,40.01 58.17,46.23 v50.15,46.23
  Bottom 0.254: 50.8,19.05 50.8,20.32 | v49.53,23.24 51.6,25.31 U1.7 | U1.44 47.62,24.32 | 47.62,24.32 48.45,24.32 v49.53,23.24 | U1.2 47.6,24.34 47.62,24.32 | C7.A 41.78,15.11 42.33,15.66 C5.2 43.84,16.32 U1.34 46.8,16.32 49.53,19.05 50.8,19.05 | 50.8,20.32 51.82,20.32 54.22,22.72 U1.14 57.9,22.72 58.93,23.75 61.85,23.75 64.77,26.67 64.77,29.72 64.43,30.06 R28.2 63.5,31.75 66.04,34.29 v71.12,34.29 72.39,34.29 74.93,31.75 R29.2 | 50.8,19.05 52.45,19.05 53.47,18.03 53.47,16.13 54,15.6 | U1.24 54,15.6 | U1.7 51.6,26.71 | U1.7 51.6,27.47 52.07,27.94 52.07,35.56 50.8,36.83 JP14.4 50.8,40.64 | 30.48,32.38 27.94,32.38 26.67,31.11 26.67,30.48 | 30.48,32.38 32.38,32.38 | 32.38,32.38 34.92,32.38 35.8,33.26 LED7.A 37.97,35.43 v38.1,35.56 | C6.2 57.15,15.37 56.9,15.62 54,15.62 54,15.6 | 50.8,20.32 50.8,21.97 v49.53,23.24 | 50.8,40.64 JP14.4-2 50.67,42.29 | v49.53,40.64 50.8,40.64 | R3.2 49.53,46.23 | 49.53,46.23 v50.15,46.23 | v64.39,40.01 64.39,40.64 | 64.39,40.64 62.23,40.64 59.65,43.22 R16.2 | 64.39,40.64 SJ1.1 | R17.2 84.67,40.22 v84.47,40.02 | R19.2 49.57,46.19 49.53,46.23 | R25.2 R26.2 R27.2 26.67,30.48 | 26.67,30.48 R24.2 25.87,29.04 25.53,28.7 23.24,28.7 22.86,29.08 22.86,30.48 16.51,36.83 16.51,39.37 12.7,43.18 7.62,43.18 6.35,41.91 R18.2 | F1.2 30.48,32.38 | C8.2 32.38,32.38

### Text on the board
tPlace: LamDiNao | SPACE | CLICK | EARTH
bPlace: BE STOKED | Open Source | Hardware | PULL-UPS | D15 | RST | GND | 5V | D16 | D14 | POWER | SPACE | CLICK | A5 | D5 | A4 | D4 | ARROWS | A3 | D3 | A2 | D2 | A1 | D1 | A0 | D0 | PAPCODIENTU | Based on Makey Makey | FABLAB SAIGON | Created by Jay Silver and Eric Rosenbaum
tRestrict: EARTH
bRestrict: OUTPUT